# Altium schematic sheet 4_AV.schdoc
size 210 x 148 mm; Symbol: tv_muban1_1; Company: 嘉立创EDA; Version: V1.0; Page Size: A4; @Project Name: LCEDAsucaiku; @Update Date: 2026-05-01; @Create Date: 2026-03-27; @Page Name: AV; @Page Count: 8; @Page No: 4; @Update Time: 08:51:41; Color: #990000; Device: sucai_muban; @Board Name: tv基板; @Create Time: 22:33:59; @Schematic Name: Schematic1; @Assembly Variant: Basic; Border: 1; Title Block Position: 3; Size: A4; Width: 826; Height: 582; Region Start: 1; X Region Count: 6; Y Region Count: 4; Blade Width: 10; SheetNumber: 4; SheetTotal: 8
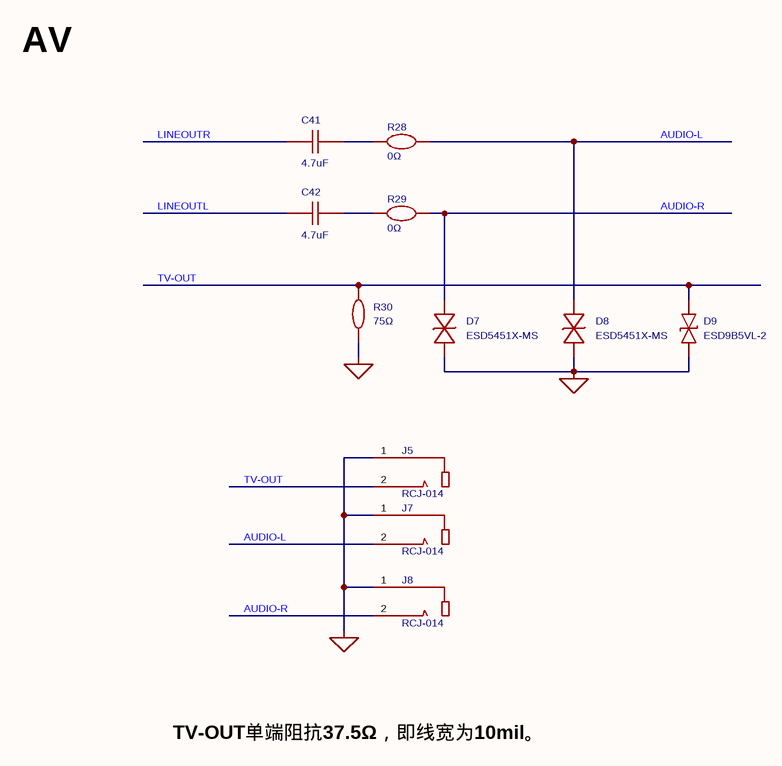
[diagram p0: 4_AV.schdoc]

## Parts
C41  4.7uF  [C0402]
C42  4.7uF  [C0402]
D7  ESD5451X-MS  [DFN1006-2L-BI]
D8  ESD5451X-MS  [DFN1006-2L-BI]
D9  ESD9B5VL-2  [DFN1006-2L-BI]
J5  RCJ-014  [CONN-TH_RCJ-013]
J7  RCJ-014  [CONN-TH_RCJ-013]
J8  RCJ-014  [CONN-TH_RCJ-013]
R28  0Ω  [R0402]
R29  0Ω  [R0402]
R30  75Ω  [R0603]

## Nets
AGND: D7.1 D8.1 D9.1 J5.1 J7.1 J8.1 R30.1
AUDIO-L: D8.2 J7.2 R28.2
AUDIO-R: D7.2 J8.2 R29.2
LINEOUTL: C42.1
LINEOUTR: C41.1
TV-OUT: D9.2 J5.2 R30.2
NetC41_2: C41.2 R28.1
NetC42_2: C42.2 R29.1

## Notes on the sheet
- AV
- TV-OUT单端阻抗37.5Ω，即线宽为10mil。
- 选手信息
- 项目名称
- 第                              幅
- 图页名称
- 共                                幅
- 当前日期
- 当前时间

## Library data of the parts
C41 C42 = GRM155C61E475ME15D: 容值:4.7uF;精度:±20%;额定电压:25V;温度系数:-;; Manufacturer: muRata(村田); AddInBom: yes; ModelId: 36a51122f27c49738f86b3bfa98863e0聨0819f05c4eef4c71ace90d822a990e87; ModelName: C0402_L1.0-W0.5-H0.5; ModelTransform: 39.37,19.685,0,0,0,0,0,0,0; Tolerance: ±20%; Voltage Rating: 25V; Symbol: GRM155C61E475ME15D; Device: GRM155C61E475ME15D; LCSC Part Name: 4.7uF ±20% 25V; SupplierPart: C5718966; ManufacturerPart: GRM155C61E475ME15D; Supplier Footprint: 0402; JLCPCB Part Class: Extended Part; Datasheet: https://item.szlcsc.com/datasheet/GRM155C61E475ME15D/6643118.html; Supplier: LCSC; ConvertToPcb: yes; FootprintName: C0402; Value: 4.7uF; Temperature Coefficient: -
D7 D8 = ESD5451X-MS: 反向截止电压(Vrwm):5V;峰值脉冲电流(Ipp):8A;击穿电压:5.6V;; Manufacturer: MSKSEMI(美森科); 3D Model: 2bdbcca3b35b49c5a8ae725a08658930聨0819f05c4eef4c71ace90d822a990e87; 3D Model Transform: 40.1574,24.4094,0,0,0,0,0,0,0; Reverse Stand-Off Voltage (Vrwm): 5V; Peak Pulse Current (Ipp): 8A; Breakdown Voltage: 5.6V; Type: ESD; AddInBom: yes; Symbol: ESD5451X-MS; Device: ESD5451X-MS; LCSC Part Name: 丝印C; Supplier Part: C7379960; Manufacturer Part: ESD5451X-MS; Supplier Footprint: DFN1006-2L; JLCPCB Part Class: Extended Part; Datasheet: https://atta.szlcsc.com/upload/public/pdf/source/20230621/69F6BD434835CFDE06A31A18B4149936.pdf; Supplier: LCSC; ConvertToPcb: yes; FootprintName: DFN1006-2L-BI; ModelName: DFN1006-2L-BI
D9 = ESD9B5VL-2: 反向截止电压(Vrwm):5V;钳位电压:12.5V;峰值脉冲功率(Ppp):80W@8/20us;击穿电压:6V;; Manufacturer: Leiditech(雷卯电子); AddInBom: yes; ModelId: 2bdbcca3b35b49c5a8ae725a08658930聨0819f05c4eef4c71ace90d822a990e87; ModelTransform: 40.1574,24.4094,0,0,0,0,0,0,0; Reverse Stand-Off Voltage (Vrwm): 5V; Clamping Voltage: 12.5V; Voltage - Breakdown: 6V; Reverse Leakage Current (Ir): 500nA; level of protection: IEC 61000-4-5；IEC 61000-4-2; Type: ESD; Junction Capacitance: 15pF; Symbol: ESD9B5VL-2; Device: ESD9B5VL-2; LCSC Part Name: ESD 5V截止; SupplierPart: C5144823; ManufacturerPart: ESD9B5VL-2; Supplier Footprint: DFN1006-2; JLCPCB Part Class: Extended Part; Datasheet: https://item.szlcsc.com/datasheet/ESD9B5VL-2/5766708.html; Supplier: LCSC; ConvertToPcb: yes; FootprintName: DFN1006-2L-BI; ModelName: DFN1006-2L-BI; Peak Pulse Power Dissipation (Ppp): 80W@8/20us
J5 J7 J8 = RCJ-014: RCA插孔; Manufacturer: CUI; AddInBom: yes; ModelId: 253d1bbf7df34a00af0459c95b34318f聨0819f05c4eef4c71ace90d822a990e87; ModelTransform: 570.865,456.692,0,0,0,0,-147.047,0,-177.165; Symbol: RCJ-014; Device: RCJ-014; LCSC Part Name: RCA插孔; SupplierPart: C4991844; ManufacturerPart: RCJ-014; Supplier Footprint: -; JLCPCB Part Class: Extended Part; Datasheet: https://item.szlcsc.com/datasheet/RCJ-014/5566715.html; Supplier: LCSC; ConvertToPcb: yes; FootprintName: CONN-TH_RCJ-013; ModelName: CONN-TH_RCJ-013
R28 R29 = FRC0402P000 TS: 电阻类型:厚膜电阻;阻值:0Ω;精度:±5%;功率:62.5mW;工作电压:50V;; Manufacturer: FOJAN(富捷); AddInBom: yes; ModelId: 98c88bc2b9094f218f3a3e30a7012738聨0819f05c4eef4c71ace90d822a990e87; ModelName: R0402_L1.0-W0.5-H0.4; ModelTransform: 39.37,19.685,0,0,0,0,0,0,0; Tolerance: ±5%; Power(Watts): 62.5mW; Voltage-Supply(Max): 50V; Symbol: FRC0402P000 TS; Device: FRC0402P000 TS; LCSC Part Name: 0Ω ±5% 62.5mW 厚膜电阻; SupplierPart: C2906877; ManufacturerPart: FRC0402P000 TS; Supplier Footprint: 0402; JLCPCB Part Class: Extended Part; Supplier: LCSC; ConvertToPcb: yes; FootprintName: R0402; Type: 厚膜电阻; Value: 0Ω; Operating Temperature: -55℃~+155℃
R30 = 0603WAF750JT5E: 电阻类型:厚膜电阻;阻值:75Ω;精度:±1%;功率:100mW;工作电压:75V;温度系数:±100ppm/℃;; Manufacturer: UNI-ROYAL(厚声); 3D Model: fc143cca1e79419f9cd78b61e9279f08聨0819f05c4eef4c71ace90d822a990e87; 3D Model Transform: 31.8897,63.7794,0,90,0,0,0,0,0; Tolerance: ±1%; Power(Watts): 100mW; Voltage-Supply(Max): 75V; AddInBom: yes; Symbol: 0603WAF750JT5E; Device: 0603WAF750JT5E; LCSC Part Name: 75Ω ±1% 100mW 厚膜电阻; Supplier Part: C4275; Manufacturer Part: 0603WAF750JT5E; Supplier Footprint: 0603; JLCPCB Part Class: Basic Part; Datasheet: https://item.szlcsc.com/datasheet/0603WAF750JT5E/4682.html; Supplier: LCSC; Type: 厚膜电阻; Value: 75Ω; Temperature Coefficient: ±100ppm/℃; Operating Temperature: -55℃~+155℃; ConvertToPcb: yes; FootprintName: R0603; ModelName: R0603